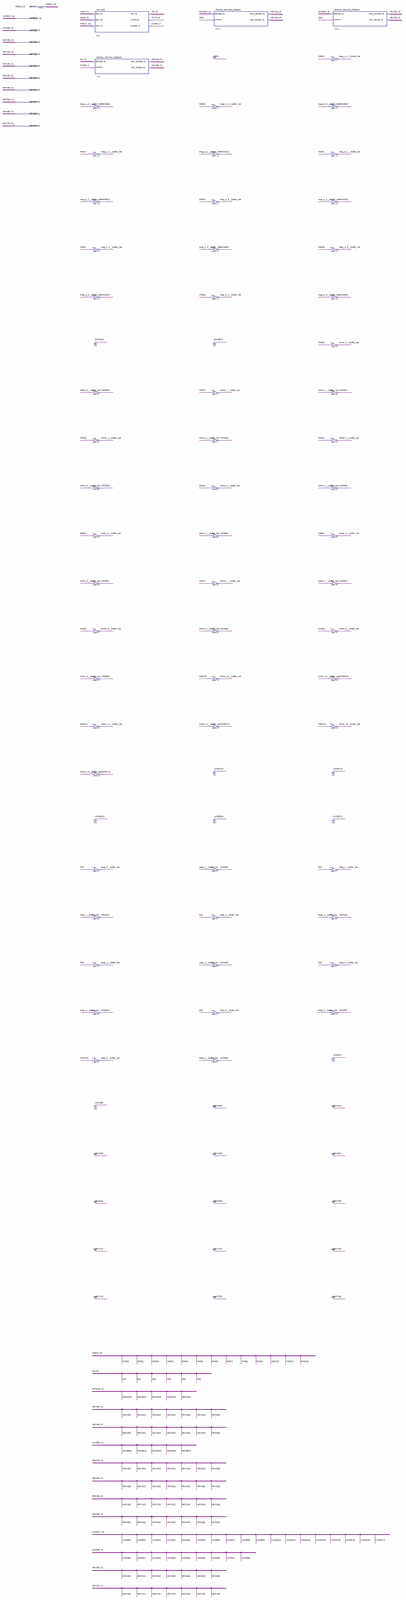
[diagram p0: schematic sheet, whole]
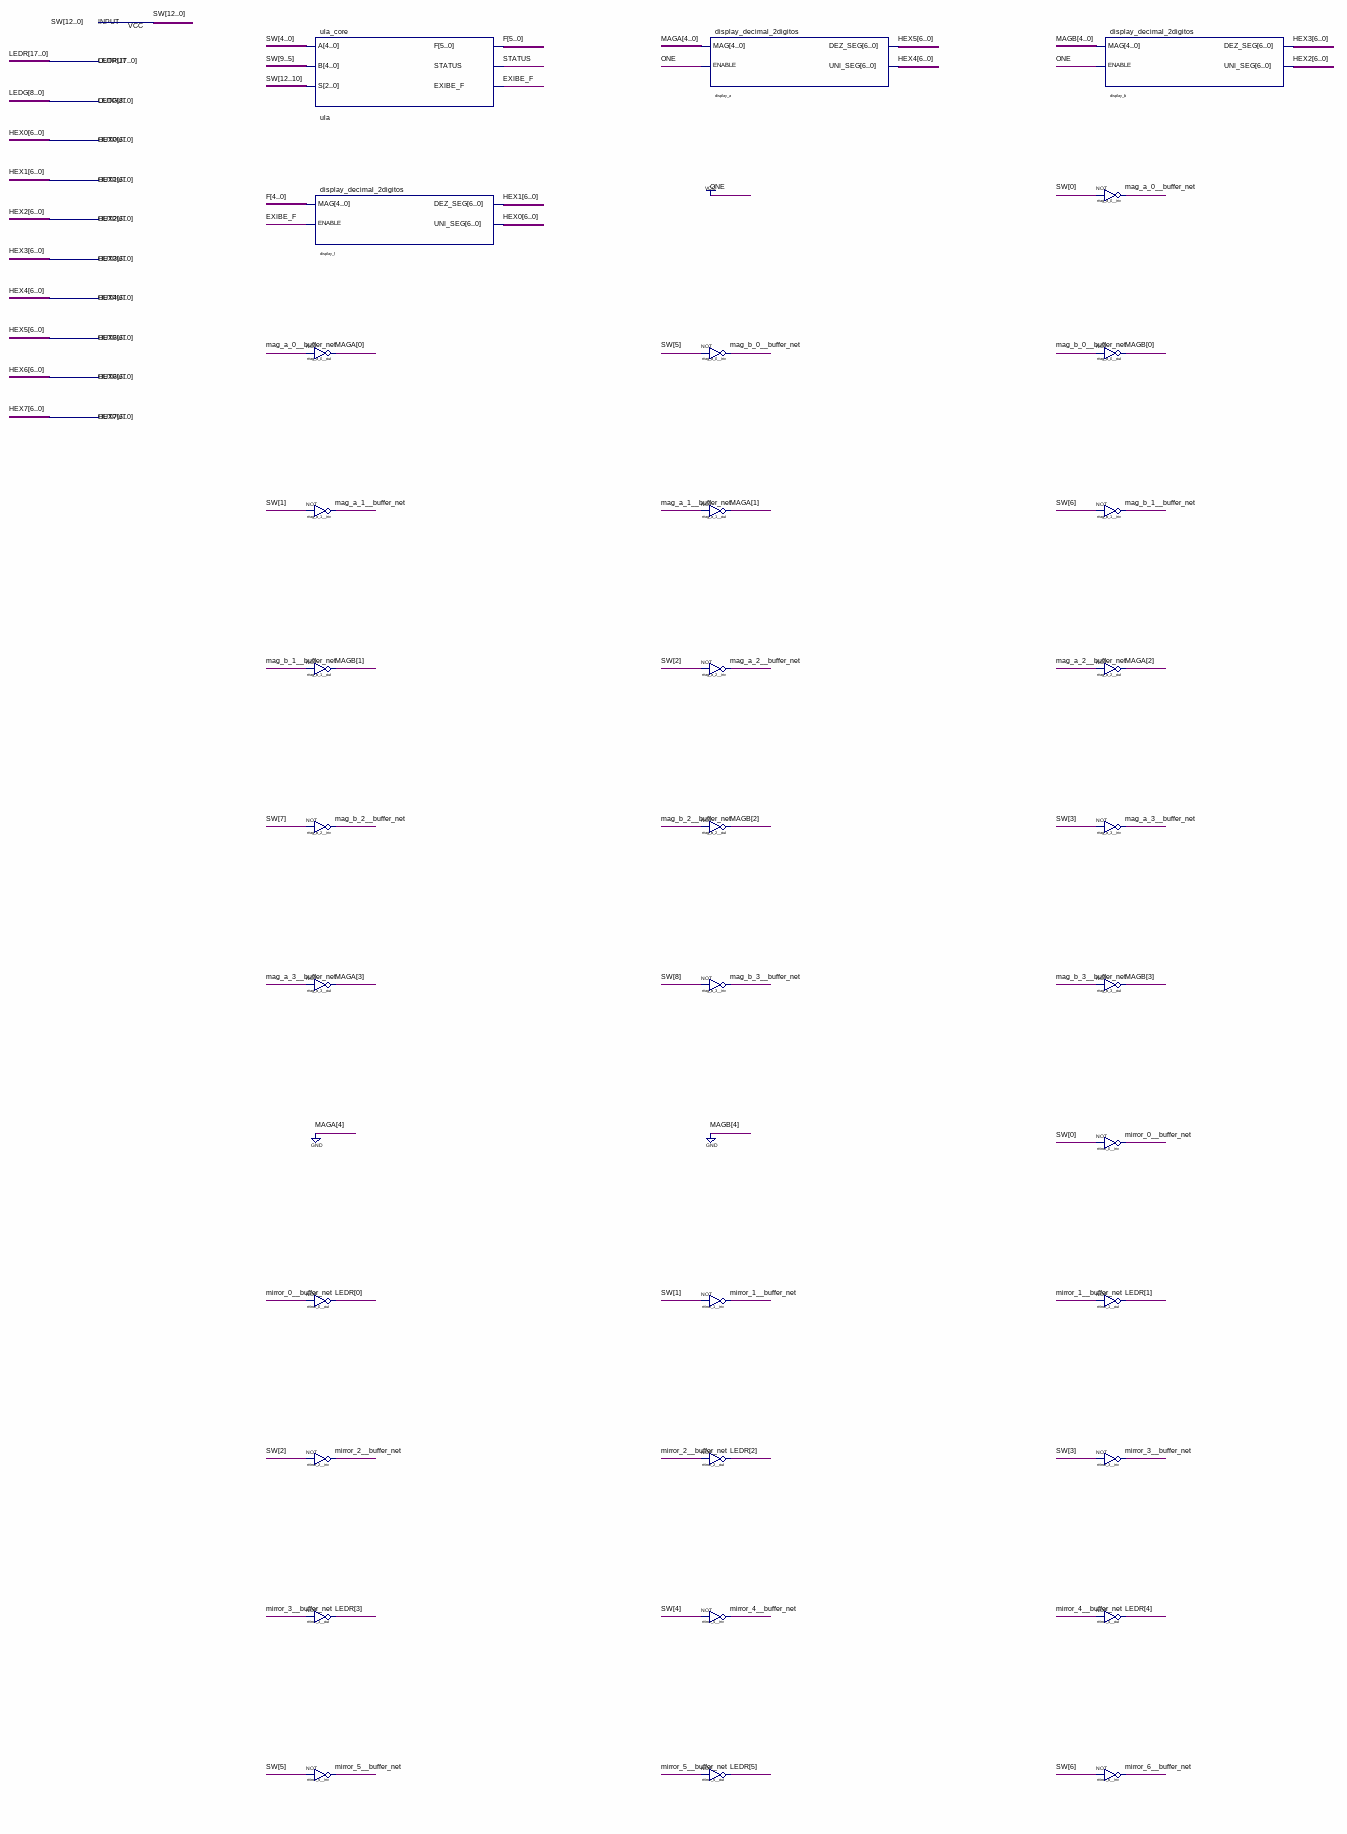
[diagram p1: schematic sheet, upper part]
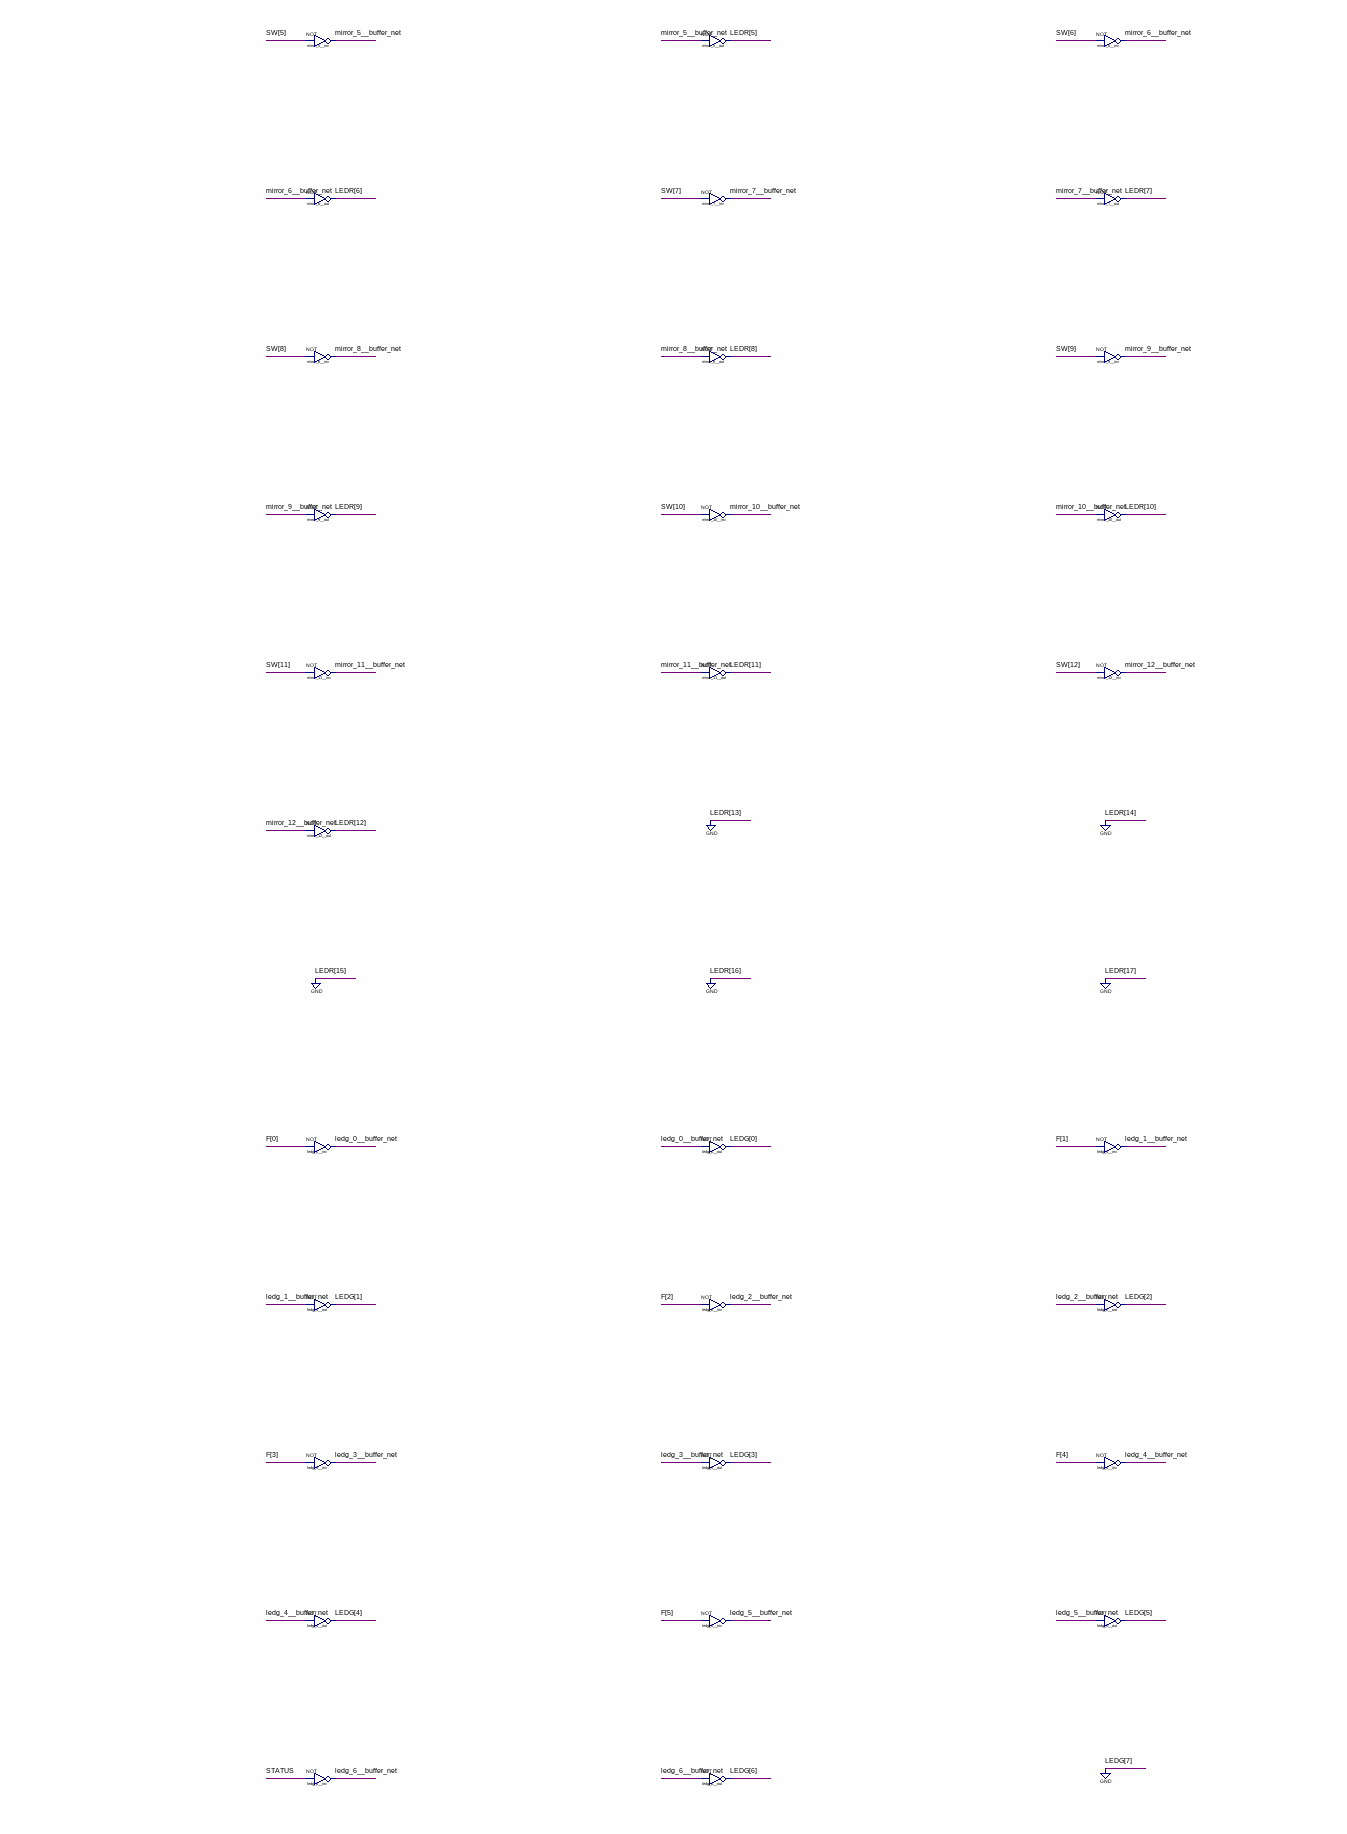
[diagram p2: schematic sheet, middle part]
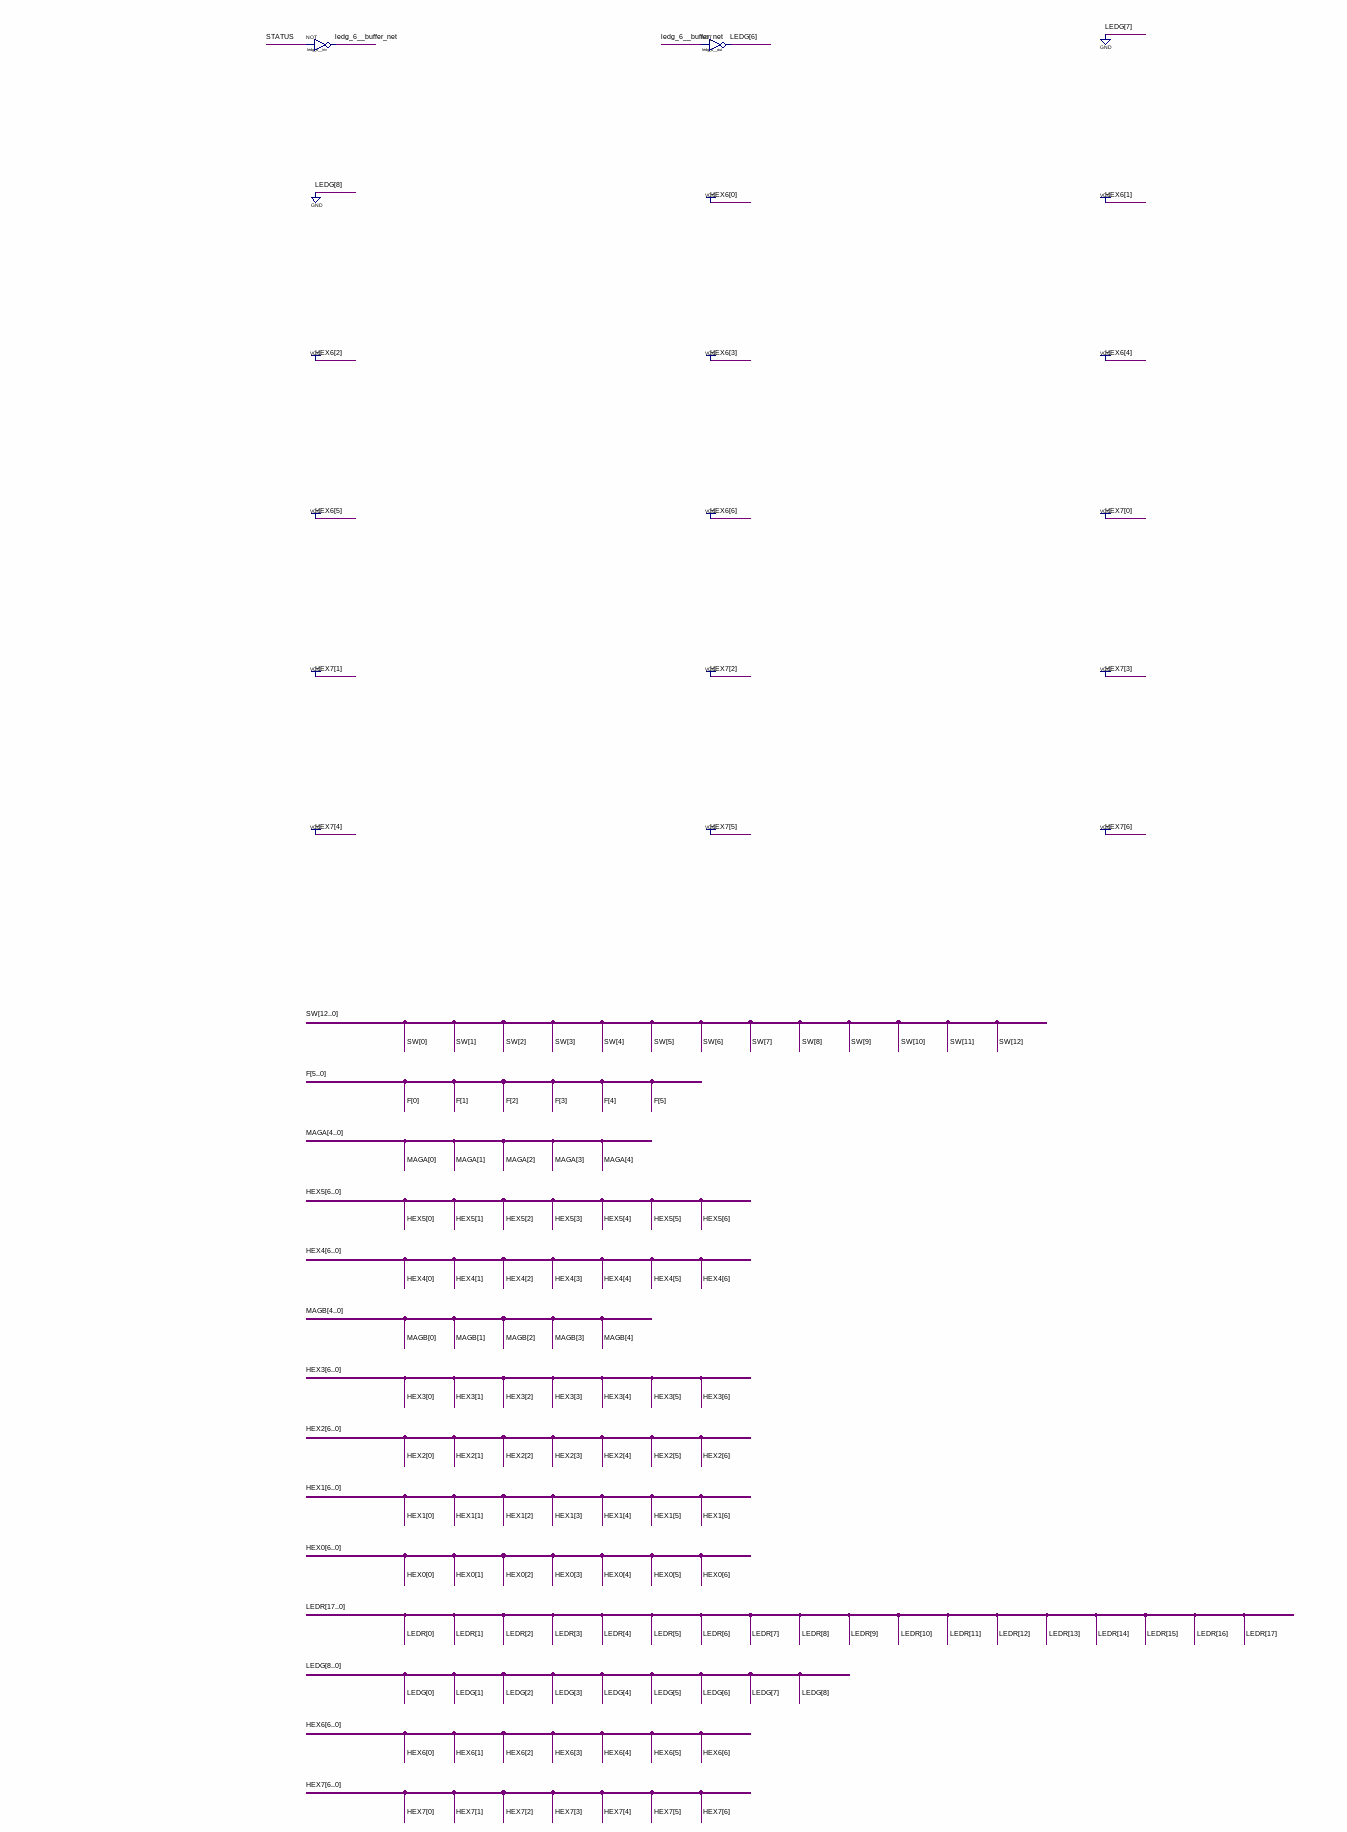
[diagram p3: schematic sheet, lower part]
// Quartus schematic ula_de2_115.bdf as structural Verilog: 60 symbols, 11 pins
module ula_de2_115 (
  input  [12:0] SW,
  output [17:0] LEDR,
  output [8:0] LEDG,
  output [6:0] HEX0,
  output [6:0] HEX1,
  output [6:0] HEX2,
  output [6:0] HEX3,
  output [6:0] HEX4,
  output [6:0] HEX5,
  output [6:0] HEX6,
  output [6:0] HEX7
);

  wire EXIBE_F, ledg_0__buffer_net, ledg_1__buffer_net, ledg_2__buffer_net, ledg_3__buffer_net,
       ledg_4__buffer_net, ledg_5__buffer_net, ledg_6__buffer_net, mag_a_0__buffer_net, mag_a_1__buffer_net,
       mag_a_2__buffer_net, mag_a_3__buffer_net, mag_b_0__buffer_net, mag_b_1__buffer_net,
       mag_b_2__buffer_net, mag_b_3__buffer_net, mirror_0__buffer_net, mirror_1__buffer_net,
       mirror_2__buffer_net, mirror_3__buffer_net, mirror_4__buffer_net, mirror_5__buffer_net,
       mirror_6__buffer_net, mirror_7__buffer_net, mirror_8__buffer_net, mirror_9__buffer_net,
       mirror_10__buffer_net, mirror_11__buffer_net, mirror_12__buffer_net, STATUS;
  wire [3:0] MAGA, MAGB;
  wire [5:0] F;

  ula_core ula (.A(SW[4:0]), .B(SW[9:5]), .S(SW[12:10]), .F(F), .STATUS(STATUS), .EXIBE_F(EXIBE_F));
  display_decimal_2digitos display_f (.MAG(F[4:0]), .ENABLE(EXIBE_F), .DEZ_SEG(HEX1), .UNI_SEG(HEX0));
  not mag_a_0__out (MAGA[0], mag_a_0__buffer_net);
  not mag_a_1__inv (mag_a_1__buffer_net, SW[1]);
  not mag_b_1__out (MAGB[1], mag_b_1__buffer_net);
  not mag_b_2__inv (mag_b_2__buffer_net, SW[7]);
  not mag_a_3__out (MAGA[3], mag_a_3__buffer_net);
  not mirror_0__out (LEDR[0], mirror_0__buffer_net);
  not mirror_2__inv (mirror_2__buffer_net, SW[2]);
  not mirror_3__out (LEDR[3], mirror_3__buffer_net);
  not mirror_5__inv (mirror_5__buffer_net, SW[5]);
  not mirror_6__out (LEDR[6], mirror_6__buffer_net);
  not mirror_8__inv (mirror_8__buffer_net, SW[8]);
  not mirror_9__out (LEDR[9], mirror_9__buffer_net);
  not mirror_11__inv (mirror_11__buffer_net, SW[11]);
  not mirror_12__out (LEDR[12], mirror_12__buffer_net);
  not ledg_0__inv (ledg_0__buffer_net, F[0]);
  not ledg_1__out (LEDG[1], ledg_1__buffer_net);
  not ledg_3__inv (ledg_3__buffer_net, F[3]);
  not ledg_4__out (LEDG[4], ledg_4__buffer_net);
  not ledg_6__inv (ledg_6__buffer_net, STATUS);
  display_decimal_2digitos display_a (.MAG({1'b0, MAGA}), .ENABLE(1'b1), .DEZ_SEG(HEX5), .UNI_SEG(HEX4));
  not mag_b_0__inv (mag_b_0__buffer_net, SW[5]);
  not mag_a_1__out (MAGA[1], mag_a_1__buffer_net);
  not mag_a_2__inv (mag_a_2__buffer_net, SW[2]);
  not mag_b_2__out (MAGB[2], mag_b_2__buffer_net);
  not mag_b_3__inv (mag_b_3__buffer_net, SW[8]);
  not mirror_1__inv (mirror_1__buffer_net, SW[1]);
  not mirror_2__out (LEDR[2], mirror_2__buffer_net);
  not mirror_4__inv (mirror_4__buffer_net, SW[4]);
  not mirror_5__out (LEDR[5], mirror_5__buffer_net);
  not mirror_7__inv (mirror_7__buffer_net, SW[7]);
  not mirror_8__out (LEDR[8], mirror_8__buffer_net);
  not mirror_10__inv (mirror_10__buffer_net, SW[10]);
  not mirror_11__out (LEDR[11], mirror_11__buffer_net);
  not ledg_0__out (LEDG[0], ledg_0__buffer_net);
  not ledg_2__inv (ledg_2__buffer_net, F[2]);
  not ledg_3__out (LEDG[3], ledg_3__buffer_net);
  not ledg_5__inv (ledg_5__buffer_net, F[5]);
  not ledg_6__out (LEDG[6], ledg_6__buffer_net);
  display_decimal_2digitos display_b (.MAG({1'b0, MAGB}), .ENABLE(1'b1), .DEZ_SEG(HEX3), .UNI_SEG(HEX2));
  not mag_a_0__inv (mag_a_0__buffer_net, SW[0]);
  not mag_b_0__out (MAGB[0], mag_b_0__buffer_net);
  not mag_b_1__inv (mag_b_1__buffer_net, SW[6]);
  not mag_a_2__out (MAGA[2], mag_a_2__buffer_net);
  not mag_a_3__inv (mag_a_3__buffer_net, SW[3]);
  not mag_b_3__out (MAGB[3], mag_b_3__buffer_net);
  not mirror_0__inv (mirror_0__buffer_net, SW[0]);
  not mirror_1__out (LEDR[1], mirror_1__buffer_net);
  not mirror_3__inv (mirror_3__buffer_net, SW[3]);
  not mirror_4__out (LEDR[4], mirror_4__buffer_net);
  not mirror_6__inv (mirror_6__buffer_net, SW[6]);
  not mirror_7__out (LEDR[7], mirror_7__buffer_net);
  not mirror_9__inv (mirror_9__buffer_net, SW[9]);
  not mirror_10__out (LEDR[10], mirror_10__buffer_net);
  not mirror_12__inv (mirror_12__buffer_net, SW[12]);
  not ledg_1__inv (ledg_1__buffer_net, F[1]);
  not ledg_2__out (LEDG[2], ledg_2__buffer_net);
  not ledg_4__inv (ledg_4__buffer_net, F[4]);
  not ledg_5__out (LEDG[5], ledg_5__buffer_net);

  assign HEX6 = {7{1'b1}};
  assign HEX7 = {7{1'b1}};
  assign LEDG[8:7] = 2'b00;
  assign LEDR[17:13] = {5{1'b0}};
endmodule
